# EAGLE design Rad Sensor EV 1 (EAGLE 7.4.0)
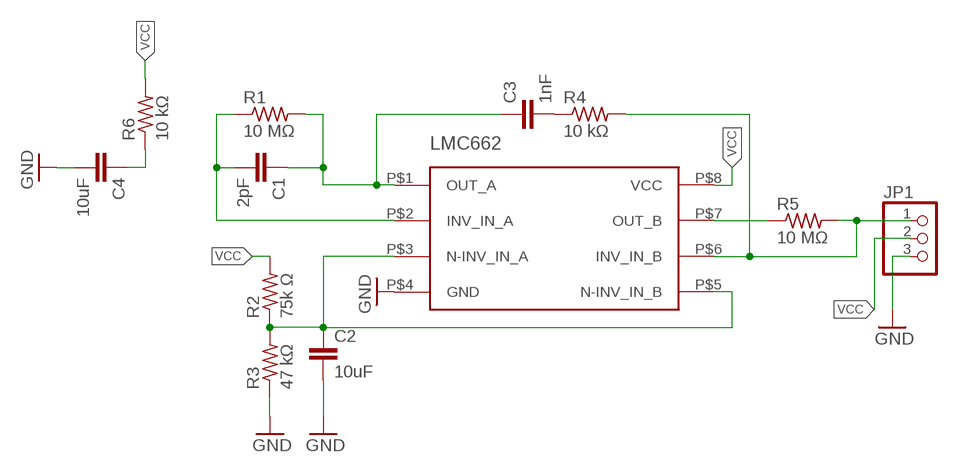
[diagram p0: schematic, sheet 1]

## Parts
C1  2pF  C-EUC0805  [C0805]
C2  10uF  C-EUC0805  [C0805]
C3  1nF  C-EUC0805  [C0805]
C4  10uF  C-EUC0805  [C0805]
JP1  PINHD-1X3  [1X03]
R1  10 MΩ  R-US_R0805  [R0805]
R2  75k Ω  R-US_R0805  [R0805]
R3  47 kΩ  R-US_R0805  [R0805]
R4  10 kΩ  R-US_R0805  [R0805]
R5  10 MΩ  R-US_R0805  [R0805]
R6  10 kΩ  R-US_R0805  [R0805]
U$1  LMC662  [LMC662]

## Nets
GND: C2.2 C4.2 JP1.3 R3.1 U$1.P$4(GND)
N$1: C1.2 R1.1 U$1.P$2(INV_IN_A)
N$2: C1.1 C3.1 R1.2 U$1.P$1(OUT_A)
N$3: C3.2 R4.1
N$4: C2.1 R2.1 R3.2 U$1.P$3(N-INV_IN_A) U$1.P$5(N-INV_IN_B)
N$5: R5.1 U$1.P$7(OUT_B)
N$6: JP1.1 R4.2 R5.2 U$1.P$6(INV_IN_B)
N$7: C4.1 R6.1
VCC: JP1.2 R2.2 R6.2 U$1.P$8(VCC)

## Library data of the parts
C1-C4 = rcl:C-EU: CAPACITOR, European symbol
JP1 = adafruit:PINHD-1X3: PIN HEADER
R1-R6 = adafruit:R-US_: RESISTOR, American symbol
U$1 = lmc662:LMC662

## Board
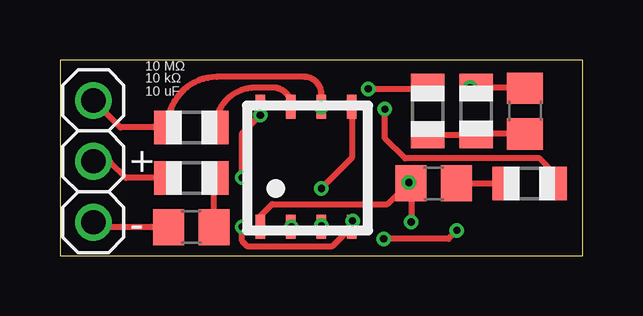
[diagram p1: board, top side]
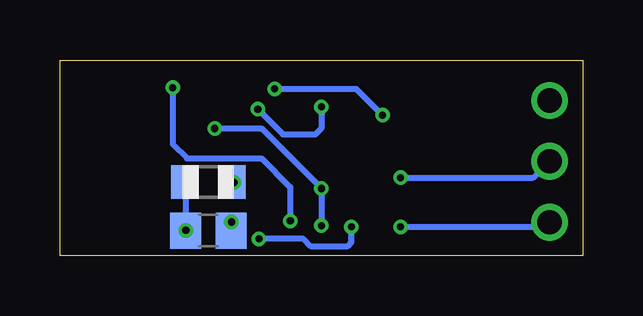
[diagram p2: board, bottom side, seen from below]

Size 21.8 x 8.15 mm. Coordinates in mm from the lower left corner, seen from the top.
Outline: 0,0 21.8,0 21.8,8.15 0,8.15 0,0
Copper layers (1*16): Top 0.035mm / dielectric 1.5mm / Bottom 0.035mm
Design rules "SeeedStudio_2layer_DRU_no_angle_20140221 *": minimum track width 6mil, minimum drill 0.3mm, track to track 6mil, track to pad 6mil, pad to pad 6mil, via to via 6mil, smd to smd 0mil, copper to edge 10mil, drill to drill 10mil, minimum pad ring 10mil, minimum via ring 6mil, stop-mask expansion 2mil, vias tented up to drill 100mil, thermal gap 10mil

### Footprints (pad centres in the part's own frame; a part is rotated, then mirrored left to right if it is on the bottom)
C0805 = smd 1.3 x 1.5: 1 -0.95,0; 2 0.95,0
1X03 = drill 1.016: 1 -2.54,0; 2 0,0; 3 2.54,0
R0805 = smd 1.1 x 1.4: 1 -1,0; 2 1,0
LMC662 = smd 0.4 x 1: P$1 -2,-2.5; P$2 -0.73,-2.5; P$3 0.54,-2.5; P$4 1.81,-2.5; P$5 1.81,2.5; P$6 0.54,2.5; P$7 -0.73,2.5; P$8 -2,2.5

### Placement (x,y rotation side)
C1  15.61,1.04 180 bottom
C2  19.39,6.02 90 top
C3  15.58,3.01 0 top
C4  5.48,1.19 180 top
JP1  1.39,3.93 270 top
R1  15.61,3.06 0 bottom
R2  15.34,6.02 90 top
R3  17.36,6.02 270 top
R4  19.58,3.01 0 top
R5  5.48,5.34 180 top
R6  5.48,3.24 180 top
U$1  10.36,3.71 0 top

### Tracks (layer width: path | path; a pad name or v marks a point on that pad's centre or on a via)
GND  (via drill 0.3)
  Top 0.254: C4.2 1.59,1.19 JP1.3 | v7.6,1.2 7.6,0.6 7.8,0.4 11.36,0.4 U$1.P$4 12.17,1.42 v12.2,1.45 | v17.1,7 R3.1 19.34,7.02 C2.2
  Bottom 0.254: v7.6,1.2 1.58,1.2 JP1.3 | v17.1,7 17.1,4.65 16.5,4.05 13.4,4.05 12.2,2.85 v12.2,1.45
N$1  (via drill 0.3)
  Top 0.254: v16.55,1.05 16.2,0.7 v13.5,0.7 | U$1.P$2 9.61,1.26 v9.65,1.2
  Bottom 0.254: R1.1 16.56,3.01 C1.2 v16.55,1.05 | v13.5,0.7 11.65,0.7 11.35,0.4 9.8,0.4 9.65,0.55 v9.65,1.2
N$2  (via drill 0.3)
  Top 0.254: C3.1 14.65,2.99 v14.65,1.4 | C3.1 14.39,3.25 | C3.1 14.55,2.98 v14.55,3.05 13.65,2.15 8.85,2.15 8.36,1.66 U$1.P$1
  Bottom 0.254: C1.1 v14.65,1.4 | R1.2 14.55,3.1 v14.55,3.05
N$3
  Top 0.254: C3.2 R4.1
N$4  (via drill 0.3)
  Top 0.254: U$1.P$3 v10.9,1.25 | U$1.P$5 12.17,4.07 v10.9,2.8 | v15.35,5.3 15.06,5.3 R2.1 R3.2 17.41,5.07 C2.1
  Bottom 0.254: v10.9,1.25 v10.9,2.8 13.4,5.3 v15.35,5.3
N$5
  Top 0.254: U$1.P$7 9.65,6.23 arc90 8.88,7 8.14,7 arc90 R5.1
N$6  (via drill 0.3)
  Top 0.254: JP1.1 2.52,5.34 R5.2 arc-90 6.54,7.45 10.2,7.45 arc-90 10.9,6.7 U$1.P$6 v10.9,6.2 | v13.55,6.1 13.55,4.9 14.4,4.05 20,4.05 20.58,3.47 R4.2
  Bottom 0.254: v10.9,6.2 10.9,5.3 11.15,5.05 12.5,5.05 v13.55,6.1
N$7
  Top 0.254: C4.1 6.43,3.19 R6.1
VCC  (via drill 0.3)
  Top 0.254: JP1.2 1.42,3.9 2.1,3.9 2.76,3.24 R6.2 | v7.6,3.25 7.6,5.1 v8.35,5.85 v8.36,5.86 U$1.P$8 | v12.85,6.95 15.27,6.95 R2.2
  Bottom 0.254: v7.6,3.25 2.07,3.25 JP1.2 | v12.85,6.95 9.45,6.95 v8.35,5.85

### Text on the board
tPlace: 10 MΩ | 10 kΩ | 10 uF | + | -